# EAGLE schematic mcp2221-breakout (EAGLE 7.4.0)
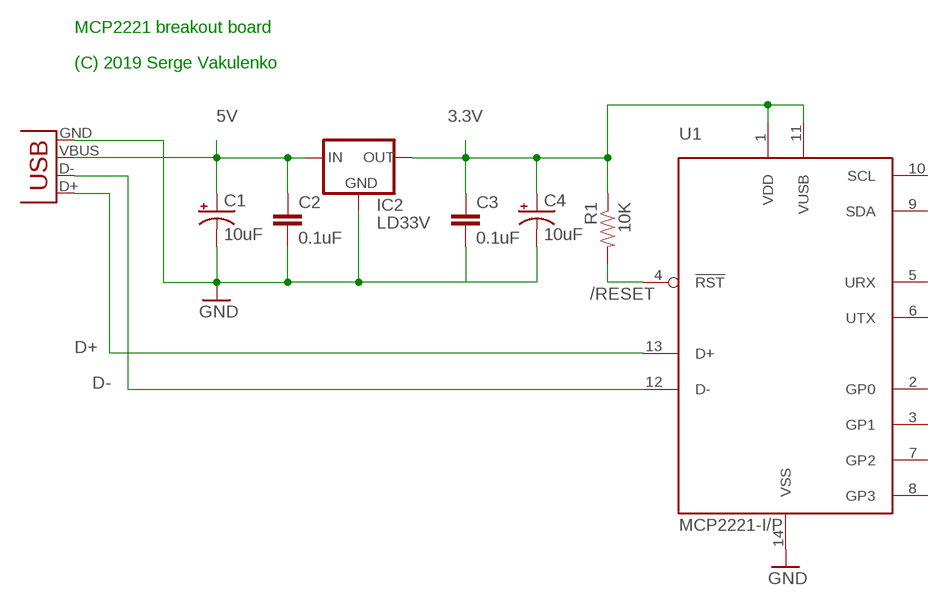
[diagram p0: schematic, sheet 1]

## Parts
C1  10uF  CAP_POLPTH2  [CPOL-RADIAL-10UF-25V]
C2  0.1uF  CAPPTH  [CAP-PTH-SMALL]
C3  0.1uF  CAPPTH1  [CAP-PTH-5MM]
C4  10uF  CAP_POLPTH2  [CPOL-RADIAL-10UF-25V]
IC2  LD33V  V_REG_78XXSIDE  [78XXL]
R1  10K  RESISTORPTH1  [AXIAL-0.3]
U1  MCP2221-I/P  [DIL14]
X1  USBPTH  [USB-B-PTH]

## Nets
3.3V: C3.1 C4.1(+) IC2.OUT R1.P$1 U1.1(VDD) U1.11(VUSB)
5V: C1.1(+) C2.1 IC2.IN X1.VBUS
/RESET: R1.P$2 U1.4(!RST)
D+: U1.13(D+) X1.D+
D-: U1.12(D-) X1.D-
GND: C1.2(-) C2.2 C3.2 C4.2(-) IC2.GND U1.14(VSS) X1.GND
Unconnected: U1.2(GP0) U1.3(GP1) U1.5(URX) U1.6(UTX) U1.7(GP2) U1.8(GP3) U1.9(SDA) U1.10(SCL)

## Notes on the sheet
- MCP2221 breakout board
- (C) 2019 Serge Vakulenko

## Library data of the parts
C1 C4 = SparkFun:CAP_POL: Capacitor Polarized These are standard SMD and PTH capacitors. Normally 10uF, 47uF, and 100uF in electrolytic and tantalum varieties. Always verify the external diameter of the through hole cap, it varies with capacity, voltage, and manufacturer. The EIA devices should be standard.
C2 C3 = SparkFun:CAP: Capacitor Standard 0603 ceramic capacitor, and 0.1" leaded capacitor.
IC2 = SparkFun:V_REG_78XX: Voltage Regulator Standard 7805 5V regulator. IGO (Input Ground Output). Spark Fun Electronics SKU : COM-00107
R1 = SparkFun:RESISTOR: Resistor Basic schematic elements and footprints for 0603, 1206, and PTH 1/10th watt (small) resistors.
U1 = microchip-mcp2221:MCP2221-*: MCP2221 in PDIP, SOIC and TSSOP package The MCP2221 is a USB-to-UART/I2C serial converter which enables USB connectivity in applications that have a UART and I2C interfaces. The device reduces external components by integrating the USB termination resistors and the oscillator needed for USB operation. The MCP2221 also has four GP pins providing miscellaneous functionalities (GPIO, USBCFG, SSPND, Clock Output, ADC, DAC, interrupt detector). Source: www.microchip.com/MCP2221 <http://www.microchip.com/wwwproducts/Devices.aspx?product=MCP2221> and www.microchipdirect.com <http://www.microchipdirect.com/ProductDetails.aspx?Category=MCP2221> Tutorial: MCP2221 by Arnauld Biganzoli <https://docs.google.com/document/d/1P3zzqCKdEXzCe--1Yyg8PClCZKsUri8pyNO7AV2daaw/edit?usp=sharing>
X1 = SparkFun:USB: USB Connectors USB-B-PTH is fully proven SKU : PRT-00139 USB-miniB is fully proven SKU : PRT-00587 USB-A-PCB is untested. USB-A-H is throughly reviewed, but untested. Spark Fun Electronics SKU : PRT-00437 USB-B-SMT is throughly reviewed, but untested. Needs silkscreen touching up. USB-A-S has not been used/tested USB-MB-H has not been used/tested